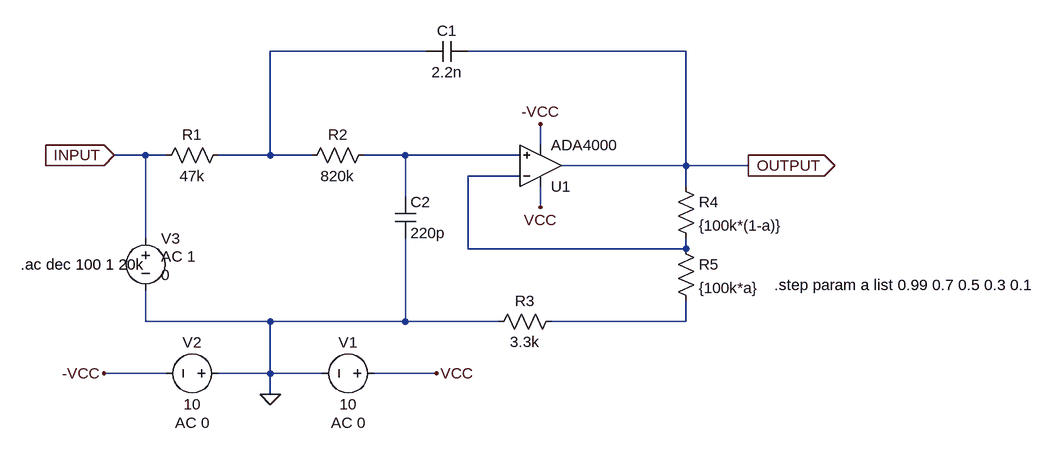
[diagram p0: schematic 1kHz-Tiefpass.asc]
1kHz-Tiefpass.asc, the LTspice schematic file:
Version 4
SHEET 1 1164 680
WIRE 256 -352 16 -352
WIRE 656 -352 320 -352
WIRE 432 -208 432 -240
WIRE -176 -192 -224 -192
WIRE -144 -192 -176 -192
WIRE 16 -192 16 -352
WIRE 16 -192 -64 -192
WIRE 80 -192 16 -192
WIRE 224 -192 160 -192
WIRE 400 -192 224 -192
WIRE 656 -176 656 -352
WIRE 656 -176 464 -176
WIRE 752 -176 656 -176
WIRE 400 -160 320 -160
WIRE 656 -144 656 -176
WIRE 224 -128 224 -192
WIRE 432 -112 432 -144
WIRE -176 -64 -176 -192
WIRE 320 -48 320 -160
WIRE 656 -48 656 -64
WIRE 656 -48 320 -48
WIRE -176 64 -176 16
WIRE 16 64 -176 64
WIRE 224 64 224 -64
WIRE 224 64 16 64
WIRE 368 64 224 64
WIRE 656 64 656 32
WIRE 656 64 448 64
WIRE -144 144 -240 144
WIRE 16 144 16 64
WIRE 16 144 -64 144
WIRE 96 144 16 144
WIRE 272 144 176 144
WIRE 16 176 16 144
FLAG 16 176 0
FLAG -224 -192 INPUT
IOPIN -224 -192 In
FLAG 752 -176 OUTPUT
IOPIN 752 -176 Out
FLAG 432 -112 VCC
FLAG 272 144 VCC
FLAG -240 144 -VCC
FLAG 432 -240 -VCC
SYMBOL res -48 -208 R90
WINDOW 0 0 56 VBottom 2
WINDOW 3 32 56 VTop 2
SYMATTR InstName R1
SYMATTR Value 47k
SYMBOL res 176 -208 R90
WINDOW 0 0 56 VBottom 2
WINDOW 3 32 56 VTop 2
SYMATTR InstName R2
SYMATTR Value 820k
SYMBOL cap 256 -336 R270
WINDOW 0 32 32 VTop 2
WINDOW 3 0 32 VBottom 2
SYMATTR InstName C1
SYMATTR Value 2.2n
SYMBOL cap 208 -128 R0
SYMATTR InstName C2
SYMATTR Value 220p
SYMBOL res 464 48 R90
WINDOW 0 0 56 VBottom 2
WINDOW 3 32 56 VTop 2
SYMATTR InstName R3
SYMATTR Value 3.3k
SYMBOL voltage -176 -80 R0
WINDOW 123 24 44 Left 2
WINDOW 39 0 0 Left 2
WINDOW 3 24 72 Left 2
SYMATTR Value2 AC 1
SYMATTR Value 0
SYMATTR InstName V3
SYMBOL res 640 -160 R0
SYMATTR InstName R4
SYMATTR Value {100k*(1-a)}
SYMBOL res 640 -64 R0
SYMATTR InstName R5
SYMATTR Value {100k*a}
SYMBOL Opamps\\ADA4000 432 -112 M180
SYMATTR InstName U1
SYMBOL voltage 192 144 R90
WINDOW 0 -32 56 VBottom 2
WINDOW 3 32 56 VTop 2
WINDOW 123 60 56 VTop 2
WINDOW 39 0 0 Left 2
SYMATTR InstName V1
SYMATTR Value 10
SYMATTR Value2 AC 0
SYMBOL voltage -48 144 R90
WINDOW 0 -32 56 VBottom 2
WINDOW 3 32 56 VTop 2
WINDOW 123 60 56 VTop 2
WINDOW 39 0 0 Left 2
SYMATTR InstName V2
SYMATTR Value 10
SYMATTR Value2 AC 0
TEXT -368 -24 Left 2 !.ac dec 100 1 20k
TEXT 792 8 Left 2 !.step param a list 0.99 0.7 0.5 0.3 0.1

The netlist it stands for:
* 1kHz-Tiefpass.asc
R1 N001 INPUT 47k
R2 N002 N001 820k
C1 N001 OUTPUT 2.2n
C2 N002 0 220p
R3 N004 0 3.3k
V3 INPUT 0 0 AC 1
R4 OUTPUT N003 {100k*(1-a)}
R5 N003 N004 {100k*a}
XU1 N002 N003 VCC -VCC OUTPUT ADA4000  ; pins In+ In- V+ V- OUT
V1 VCC 0 10 AC 0
V2 0 -VCC 10 AC 0
.ac dec 100 1 20k
.step param a list 0.99 0.7 0.5 0.3 0.1
.lib ADI.lib
.backanno
.end